# Altium schematic sheet MCU.SchDoc
size A
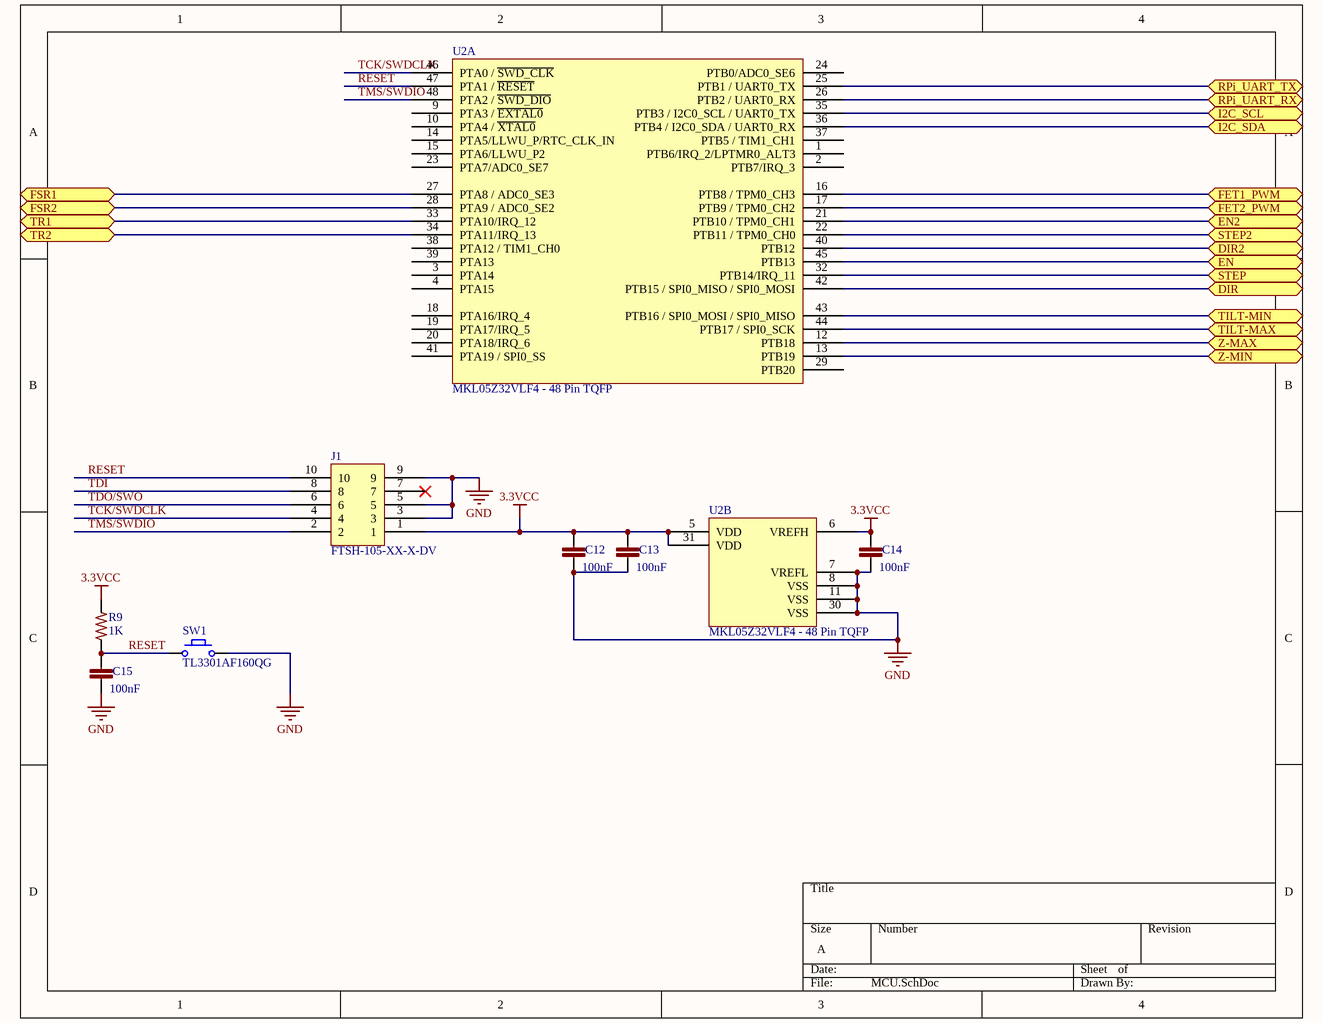
[diagram p0: MCU.SchDoc]

## Parts
C12  100nF  [C0402]
C13  100nF  [C0402]
C14  100nF  [C0402]
C15  100nF  [C0402]
J1  FTSH-105-XX-X-DV  [FTSH-105-XX-X-DV]
R9  1K  [R0603]
SW1  TL3301AF160QG  [TL3301AF160QG]
U2  MKL05Z32VLF4 - 48 Pin TQFP  (parts A,B of 2)

## Ports
DIR, DIR2, EN, EN2, FET1_PWM, FET2_PWM, FSR1, FSR2, I2C_SCL, I2C_SDA, RPi_UART_RX, RPi_UART_TX, STEP, STEP2, TILT-MAX, TILT-MIN, TR1, TR2, Z-MAX, Z-MIN

## Nets
3.3VCC: C12.1 C13.1 C14.1 J1.1 R9.2 U2.5(VDD) U2.6(VREFH) U2.31(VDD)
GND: C12.2 C13.2 C14.2 C15.2 J1.3 J1.5 J1.9 SW1.2 U2.7(VREFL) U2.8(VSS) U2.11(VSS) U2.30(VSS)
DIR: U2.42(PTB15_/_SPI0_MISO_/_SPI0_MOSI) ; port DIR
DIR2: U2.40(PTB12) ; port DIR2
EN: U2.45(PTB13) ; port EN
EN2: U2.21(PTB10_/_TPM0_CH1) ; port EN2
FET1_PWM: U2.16(PTB8_/_TPM0_CH3) ; port FET1_PWM
FET2_PWM: U2.17(PTB9_/_TPM0_CH2) ; port FET2_PWM
FSR1: U2.27(PTA8_/_ADC0_SE3) ; port FSR1
FSR2: U2.28(PTA9_/_ADC0_SE2) ; port FSR2
I2C_SCL: U2.35(PTB3_/_I2C0_SCL_/_UART0_TX) ; port I2C_SCL
I2C_SDA: U2.36(PTB4_/_I2C0_SDA_/_UART0_RX) ; port I2C_SDA
RESET: C15.1 J1.10 R9.1 SW1.1 U2.47(PTA1_/_~{RESET})
RPi_UART_RX: U2.26(PTB2_/_UART0_RX) ; port RPi_UART_RX
RPi_UART_TX: U2.25(PTB1_/_UART0_TX) ; port RPi_UART_TX
STEP: U2.32(PTB14/IRQ_11) ; port STEP
STEP2: U2.22(PTB11_/_TPM0_CH0) ; port STEP2
TCK/SWDCLK: J1.4 U2.46(PTA0_/_~{SWD_CLK})
TDI: J1.8
TDO/SWO: J1.6
TILT-MAX: U2.44(PTB17_/_SPI0_SCK) ; port TILT-MAX
TILT-MIN: U2.43(PTB16_/_SPI0_MOSI_/_SPI0_MISO) ; port TILT-MIN
TMS/SWDIO: J1.2 U2.48(PTA2_/_~{SWD_DIO})
TR1: U2.33(PTA10/IRQ_12) ; port TR1
TR2: U2.34(PTA11/IRQ_13) ; port TR2
Z-MAX: U2.12(PTB18) ; port Z-MAX
Z-MIN: U2.13(PTB19) ; port Z-MIN

Not connected (* = marked no-connect by the designer): J1 7*; U2 1(PTB6/IRQ_2/LPTMR0_ALT3) 2(PTB7/IRQ_3) 3(PTA14) 4(PTA15) 9(PTA3_/_~{EXTAL0}) 10(PTA4_/_~{XTAL0}) 14(PTA5/LLWU_P/RTC_CLK_IN) 15(PTA6/LLWU_P2) 18(PTA16/IRQ_4) 19(PTA17/IRQ_5) 20(PTA18/IRQ_6) 23(PTA7/ADC0_SE7) 24(PTB0/ADC0_SE6) 29(PTB20) 37(PTB5_/_TIM1_CH1) 38(PTA12_/_TIM1_CH0) 39(PTA13) 41(PTA19_/_SPI0_SS)

## Library data of the parts
C12-C15 = GRM155R71C104KA88D: CAP CER 0402 100nF 16V 10% X7R; LastRevisionNote: ImportComponents; Published: 23-Apr-2014; Publisher: UltiMachine; LastRevisionDate: 23-Apr-2014; ManufacturerPartNumber: GRM155R71C104KA88D; VALUE: 100nF
J1 = ARM Cortex JTAG-DEBUG Header
R9 = ERJ-3EKF1001V: RES 0603 1K 100mW 1%; LastRevisionNote: ImportComponents; Published: 23-Apr-2014; Publisher: UltiMachine; LastRevisionDate: 23-Apr-2014; ManufacturerPartNumber: ERJ-3EKF1001V; VALUE: 1K
U2 = MKL05Z32VLF4 - 48 Pin TQFP: ARM Cortex M0+
SW1 = TL3301AF160QG: MFR: *; MFR#: TL3301AF160QG; Type: SMD Momentary Tactile Switch; Height: *